# EAGLE design RAILbooster (EAGLE 6.1)
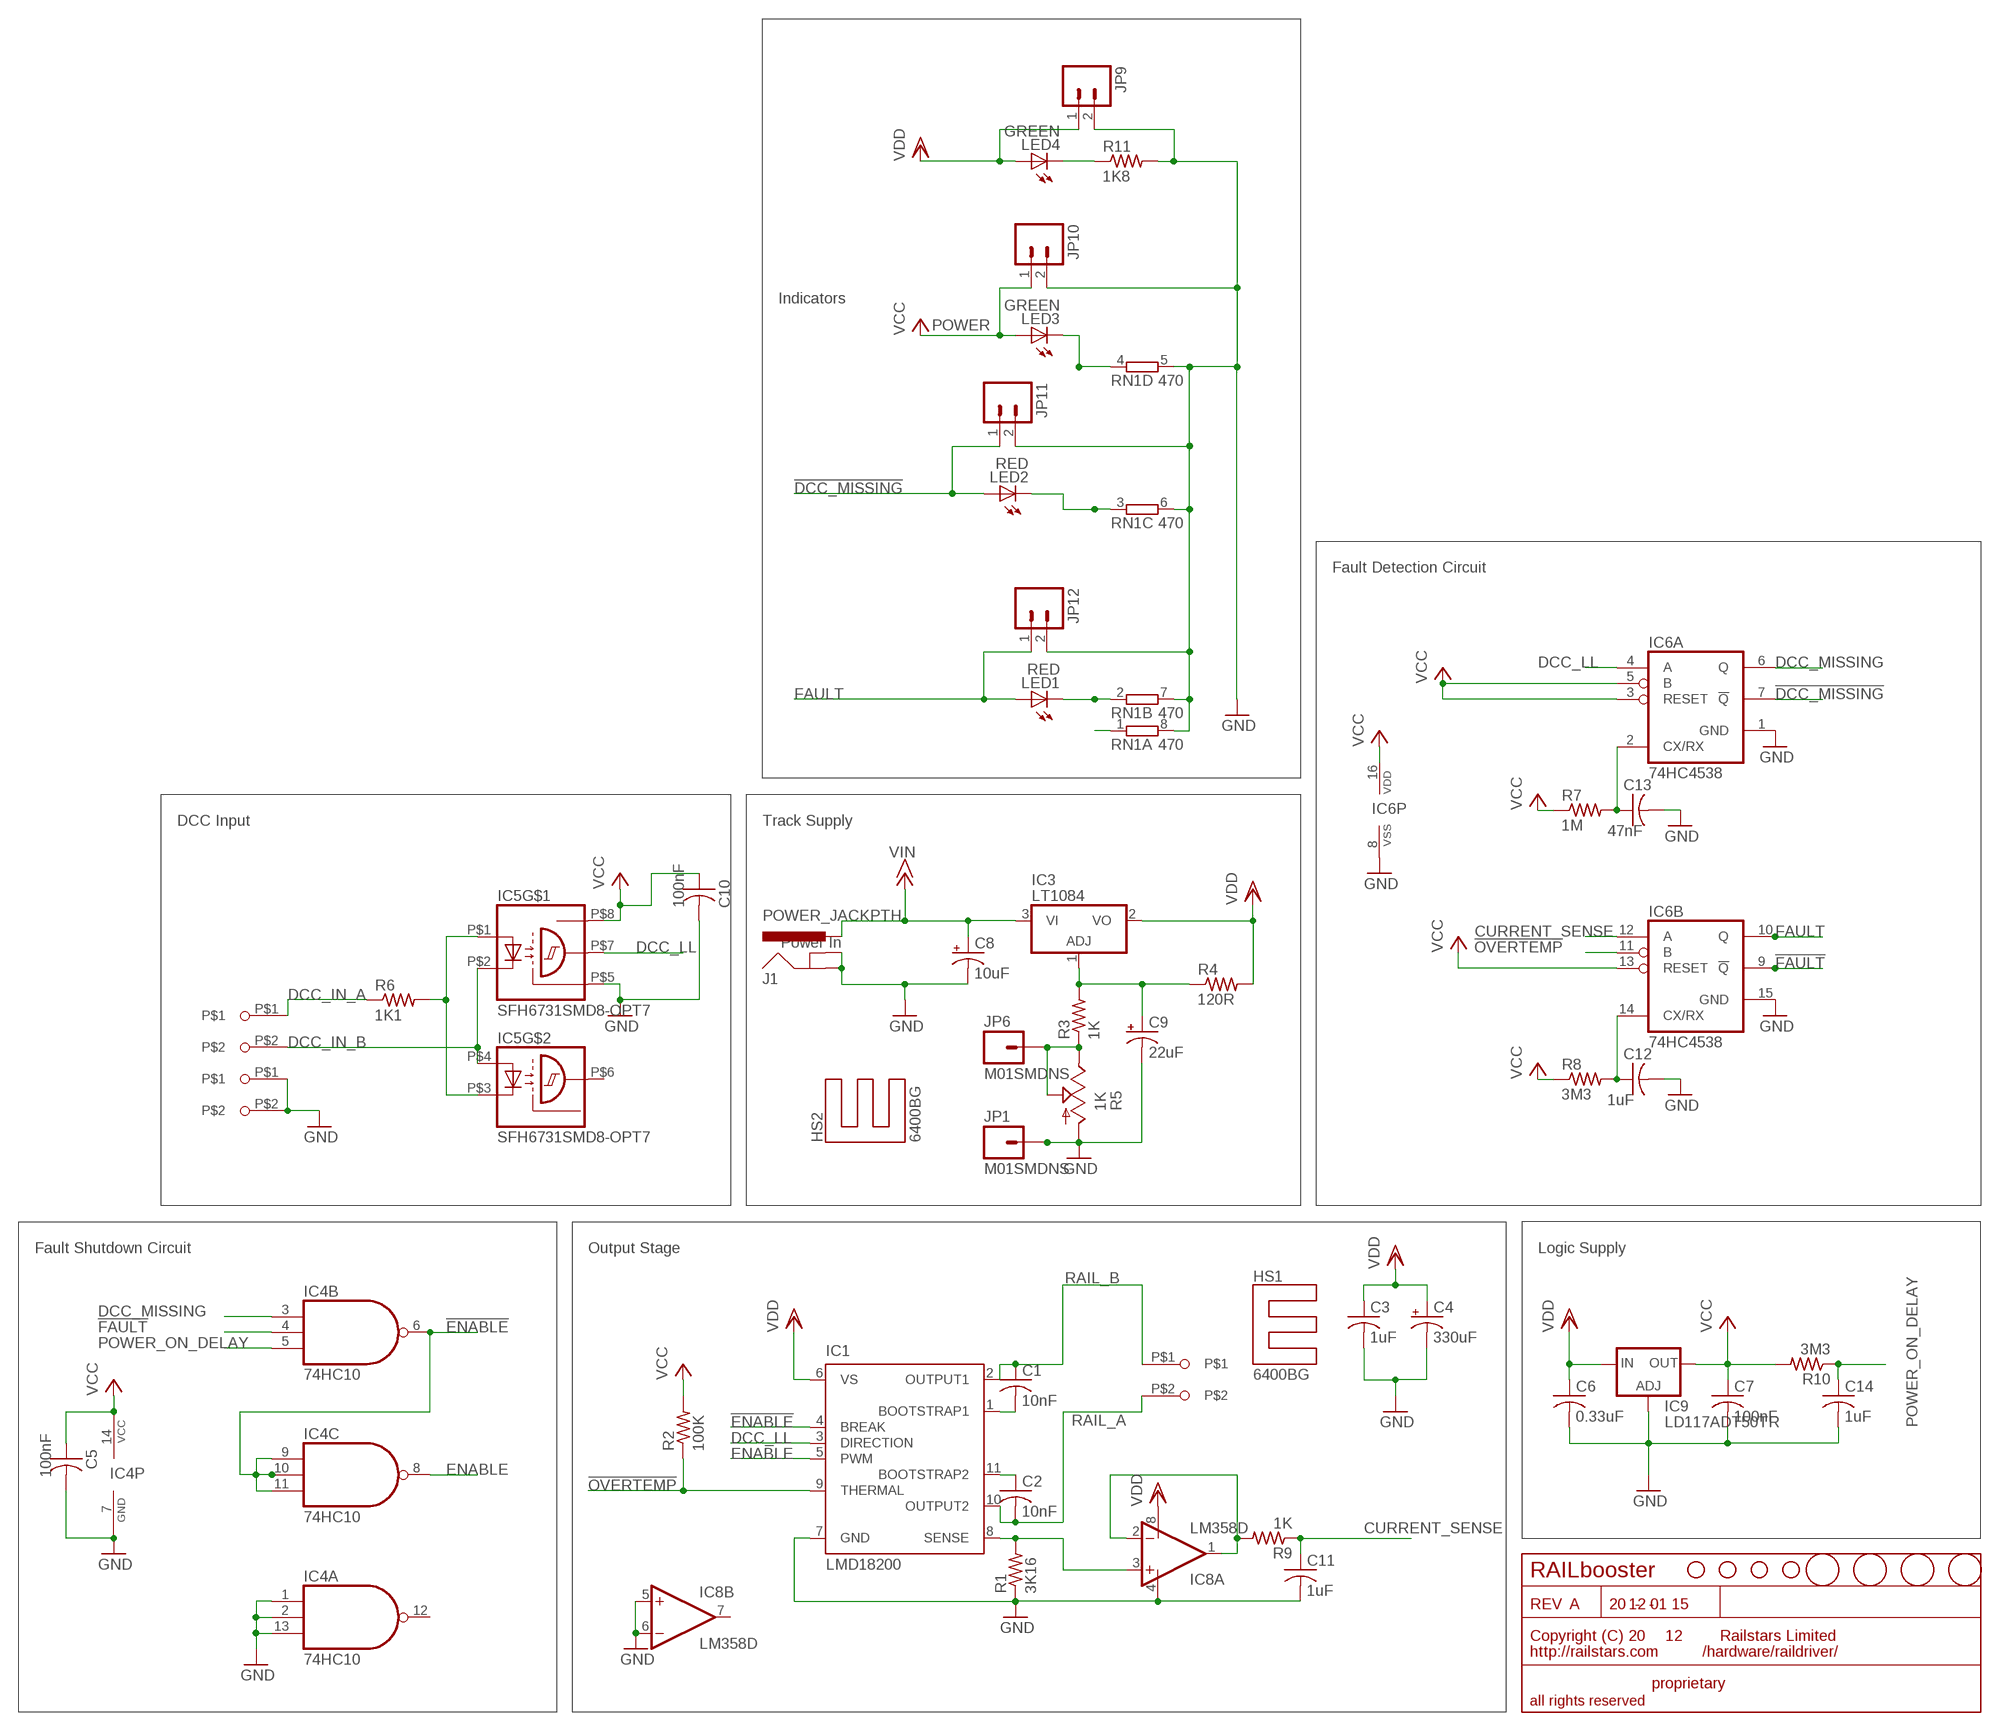
[diagram p0: schematic, sheet 1]

## Parts
C1  10nF  C-USC0603  [C0603]
C2  10nF  C-USC0603  [C0603]
C3  1uF  C-USC0603  [C0603]
C4  330uF  CPOL-USE5-10.5  [E5-10,5]
C5  100nF  C-USC0603  [C0603]
C6  0.33uF  C-USC0603  [C0603]
C7  100nF  C-USC0603  [C0603]
C8  10uF  CPOL-USE2-5  [E2-5]
C9  22uF  CPOL-USE2-5  [E2-5]
C10  100nF  C-USC0603  [C0603]
C11  1uF  C-USC0603  [C0603]
C12  1uF  C-USC0603  [C0603]
C13  47nF  C-USC0603  [C0603]
C14  1uF  C-USC0603  [C0603]
HS1  6400BG  HEATSINK6400BG  [6400BG]
HS2  6400BG  HEATSINK6400BG  [6400BG]
IC1  LMD18200  LM18200T  [TO-220-11]
IC3  LT1084  LT1084CT  [TO-220]
IC4  74HC10  7410D  [SO14]
IC5  SFH6731SMD8-OPT7  [SMD8-OPT7]
IC6  74HC4538  74HC4538SOIC  [SOIC-16]
IC8  LM358D  [SO08]
IC9  LD117ADT50TR  [DPACK]
J1  POWER_JACKPTH  [POWER_JACK_PTH]
JP1  M01SMDNS  [1X01NS]
JP2  STAND-OFF  [STAND-OFF]
JP3  STAND-OFF  [STAND-OFF]
JP4  STAND-OFF  [STAND-OFF]
JP5  STAND-OFF  [STAND-OFF]
JP6  M01SMDNS  [1X01NS]
JP9  M02PTH  [1X02]
JP10  M02PTH  [1X02]
JP11  M02PTH  [1X02]
JP12  M02PTH  [1X02]
LED1  RED  LED0603  [LED-0603]
LED2  RED  LED0603  [LED-0603]
LED3  GREEN  LED0603  [LED-0603]
LED4  GREEN  LED0603  [LED-0603]
R1  3K16  R-US_R0603  [R0603]
R2  100K  R-US_R0603  [R0603]
R3  1K  R-US_R1206  [R1206]
R4  120R  R-US_R0603  [R0603]
R5  1K  TRIM_US-S64W  [S64W]
R6  1K1  R-US_R1206  [R1206]
R7  1M  R-US_R0603  [R0603]
R8  3M3  R-US_R0603  [R0603]
R9  1K  R-US_R1206  [R1206]
R10  3M3  R-US_R0603  [R0603]
R11  1K8  R-US_R1206  [R1206]
RN1  470  4R-NEXBS8V  [EXBS8V]
U$1  RAILSTARS_LOGO20MM  [RAILSTARS_1IN]
U$5  FIDUCIAL  [FIDUCIAL_1MM]
U$6  FIDUCIAL  [FIDUCIAL_1MM]
U$7  FIDUCIAL  [FIDUCIAL_1MM]
U$8  FIDUCIAL  [FIDUCIAL_1MM]
X1  SCREWTERMINAL-5.08-2  [SCREWTERMINAL-5.08-2]
X3  SCREWTERMINAL-5.08-2  [SCREWTERMINAL-5.08-2]
X4  SCREWTERMINAL-5.08-2  [SCREWTERMINAL-5.08-2]

## Nets
!DCC_MISSING: IC6.7(A:!Q) JP11.1 LED2.A
!ENABLE: IC1.4(BREAK) IC4.6(B:O) IC4.9(C:I0) IC4.10(C:I1) IC4.11(C:I2)
!FAULT: IC4.4(B:I1) IC6.9(B:!Q)
!OVERTEMP: IC1.9(THERMAL) IC6.11(B:B) R2.1
CURRENT_SENSE: C11.1 IC6.12(B:A) R9.1
CURRENT_SENSE_UNBUFFERED: IC8.1(A:OUT) IC8.2(A:-IN) R9.2
CXRXA: C13.1 IC6.2(A:CX/RX) R7.2
CXRXB: C12.1 IC6.14(B:CX/RX) R8.2
DCC_IN_A: R6.1 X1.P$1
DCC_IN_B: IC5.P$2(C) IC5.P$4(A) X1.P$2
DCC_LL: IC1.3(DIRECTION) IC5.P$7(OUT) IC6.4(A:A)
DCC_MISSING: IC4.3(B:I0) IC6.6(A:Q)
ENABLE: IC1.5(PWM) IC4.8(C:O)
FAULT: IC6.10(B:Q) JP12.1 LED1.A
GND: C3.2 C4.- C5.2 C6.2 C7.2 C8.- C9.- C10.2 C11.2 C12.2 C13.2 C14.2 IC1.7(GND) IC4.1(A:I0) IC4.2(A:I1) IC4.7(P:GND) IC4.13(A:I2) IC5.P$5(GND) IC6.1(A:GND) IC6.8(P:VSS) IC6.15(B:GND) IC8.4(P:V-) IC8.5(B:+IN) IC8.6(B:-IN) IC9.1(ADJ) J1.GND J1.GNDBREAK JP1.1 JP9.2 JP10.2 JP11.2 JP12.2 R1.1 R5.A R11.2 RN1.5 RN1.6 RN1.7 RN1.8 X3.P$1 X3.P$2
N$1: JP6.1 R3.1 R5.E R5.S
N$2: C1.2 IC1.1(BOOTSTRAP1)
N$3: C2.1 IC1.11(BOOTSTRAP2)
N$4: IC1.8(SENSE) IC8.3(A:+IN) R1.2
N$5: LED3.C RN1.4
N$6: C9.+ IC3.1(ADJ) R3.2 R4.1
N$7: IC5.P$1(A) IC5.P$3(C) R6.2
N$9: LED2.C RN1.3
N$10: LED1.C RN1.2
N$13: LED4.C R11.1
N$17: RN1.1
POWER_ON_DELAY: C14.1 IC4.5(B:I2) R10.1
RAIL_A: C2.2 IC1.10(OUTPUT2) X4.P$2
RAIL_B: C1.1 IC1.2(OUTPUT1) X4.P$1
VCC: C5.1 C7.1 C10.1 IC4.14(P:VCC) IC5.P$8(VCC) IC6.3(A:RESET) IC6.5(A:B) IC6.13(B:RESET) IC6.16(P:VDD) IC9.4(OUT) JP10.1 LED3.A R2.2 R7.1 R8.1 R10.2
VDD: C3.1 C4.+ C6.1 IC1.6(VS) IC3.2(VO) IC8.8(P:V+) IC9.3(IN) JP9.1 LED4.A R4.2
VIN: C8.+ IC3.3(VI) J1.PWR
Unconnected: IC4.12(A:O) IC5.P$6(OUT) IC8.7(B:OUT)

## Notes on the sheet
- Indicators
- POWER
- Fault Detection Circuit
- DCC Input | Track Supply
- Power In
- Fault Shutdown Circuit | Output Stage | Logic Supply
- RAILbooster
- A | 12 01 15
- 12
- /hardware/raildriver/
- proprietary
- all rights reserved

## Library data of the parts
C1-C3 C5-C7 C10-C14 = rcl:C-US: CAPACITOR, American symbol
C4 C8 C9 = rcl:CPOL-US: POLARIZED CAPACITOR, American symbol
HS1 HS2 = Artificial Science:HEATSINK
IC1 = national-semiconductor:LM18200T: 3A, 55V H-Bridge Motor Control SourcE: http://cache.national.com/ds/LM/LMD18200.pdf; OC_FARNELL: unknown; OC_NEWARK: unknown
IC3 = Artificial Science:LT1084CT
IC4 = 74xx-us:74*10: Triple 3-input NAND gate
IC5 = Artificial Science:SFH6731
IC6 = Artificial Science:74HC4538
IC8 = linear:LM358: OP AMP also LM158; LM258; LM2904 Source: http://cache.national.com/ds/LM/LM158.pdf
IC9 = v-reg:LD117A?*: Low drop fixed and adjustable positive voltage regulators 1 A Source: http://www.st.com/stonline/products/literature/ds/7194/ld1117axx.pdf
J1 = SparkFun:POWER_JACK: Power Jack This is the standard 5.5mm barrel jack for power. The PTH is the most common, proven, reliable, footprint. All others are experimental. The Slot footprint only works if the mill layer is transmitted to the PCB fab house so be warned. Spark Fun Electronics SKU : PRT-00119. Mating wall wart : TOL-00298 (and others)
JP1 JP6 = SparkFun-Connectors:M01: Header 1 Standard 1-pin 0.1" header. Use with straight break away headers (SKU : PRT-00116), right angle break away headers (PRT-00553), swiss pins (PRT-00743), machine pins (PRT-00117), and female headers (PRT-00115).
JP2-JP5 = SparkFun:STAND-OFF: Stand Off This is the mechanical footprint for a #4 phillips button head screw. Use the keepout ring to avoid running the screw head into surrounding components. SKU : PRT-00447
JP9-JP12 = SparkFun-Connectors:M02: Header 2 Standard 2-pin 0.1" header. Use with straight break away headers (SKU : PRT-00116), right angle break away headers (PRT-00553), swiss pins (PRT-00743), machine pins (PRT-00117), and female headers (PRT-00115). Molex polarized connector foot print use with SKU : PRT-08233 with associated crimp pins and housings.
LED1-LED4 = SparkFun:LED: LEDs Standard schematic elements and footprints for 5mm, 3mm, 1206, and 0603 sized LEDs. 5mm - Spark Fun Electronics SKU : COM-00529 (and others)
R1-R4 R6-R11 = rcl:R-US_: RESISTOR, American symbol
R5 = pot:TRIM_US-: POTENTIOMETER
RN1 = resistor-dil:4R-N: Array Chip Resistor Source: RS Component / Phycomp; OC_FARNELL: unknown; OC_NEWARK: unknown
U$1 = Artificial Science:RAILSTARS_LOGO
U$5-U$8 = adafruit:FIDUCIAL: For use by pick and place machines to calibrate the vision/machine, 1mm By microbuilder.eu
X1 X3 X4 = Artificial Science:SCREWTERMINAL-5.08-2

## Board
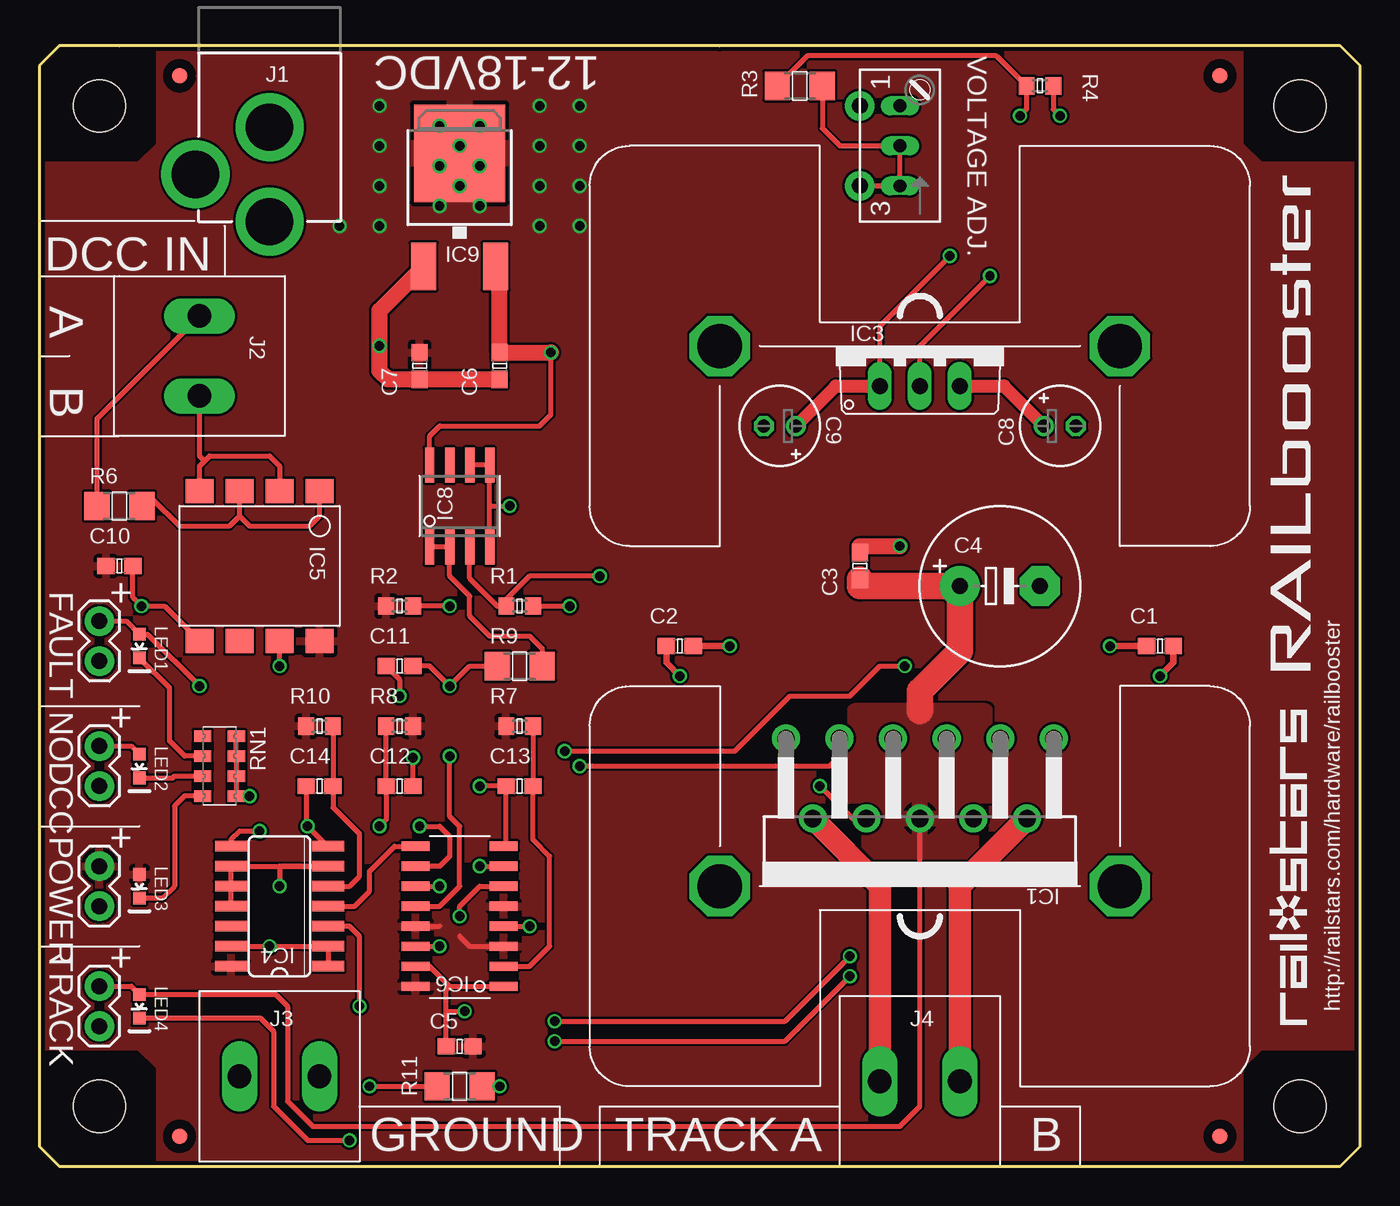
[diagram p1: board, top side]
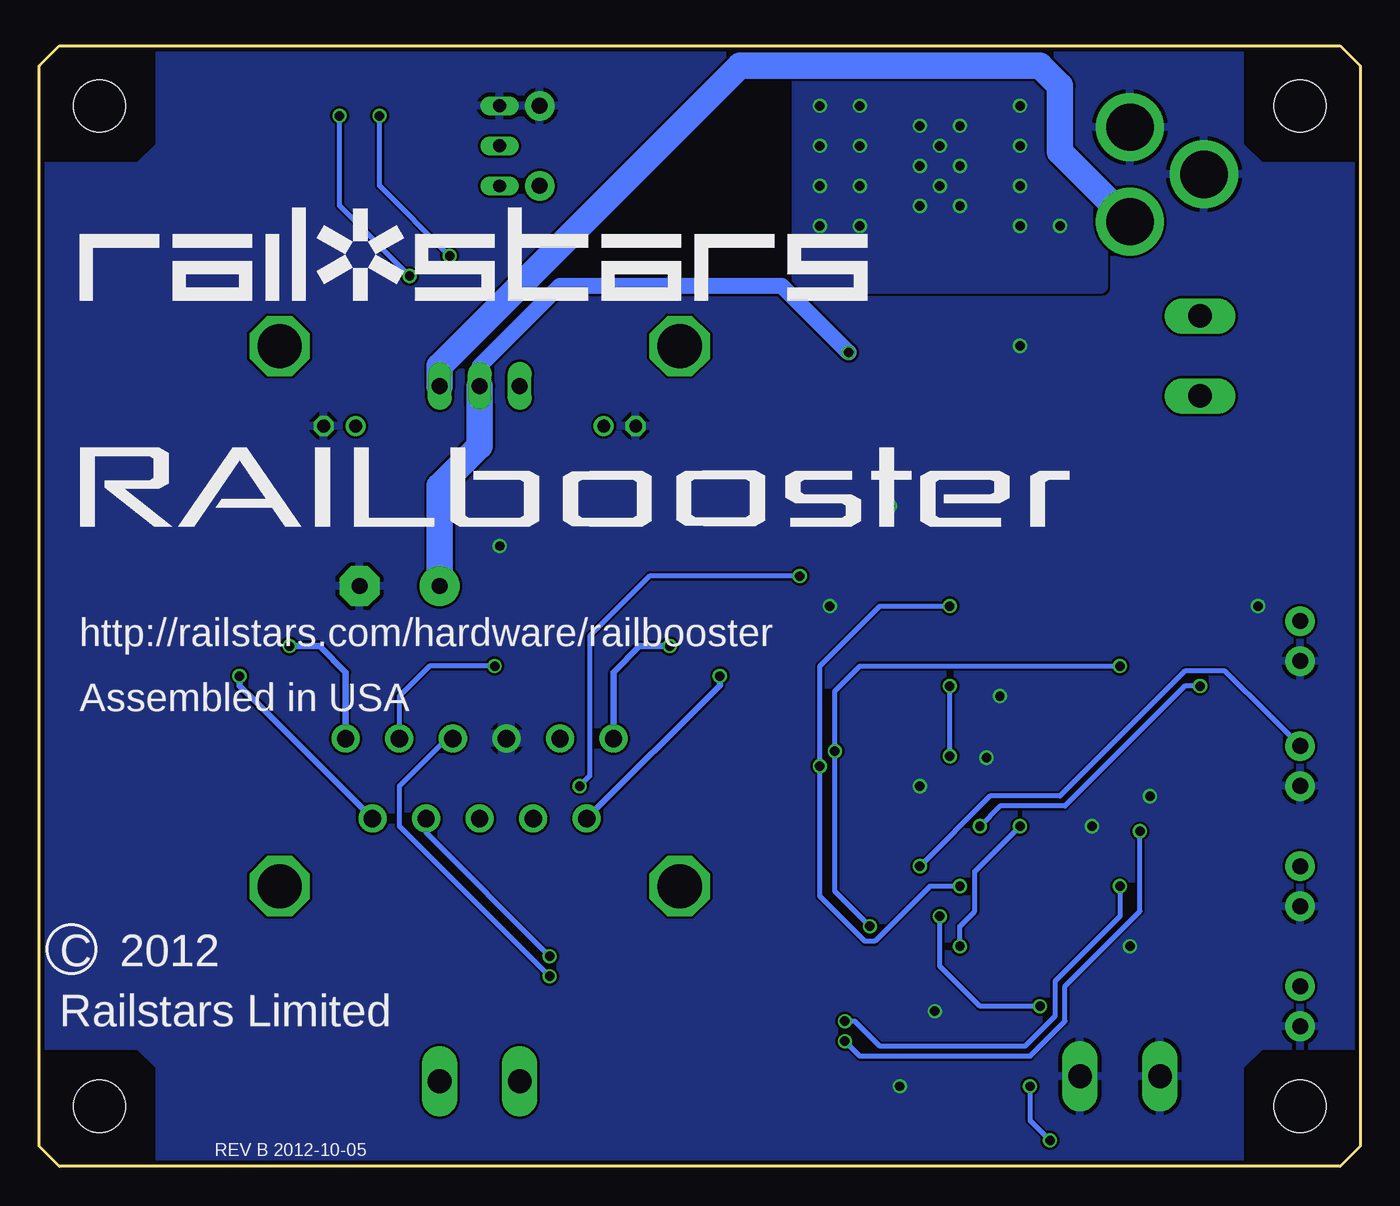
[diagram p2: board, bottom side, seen from below]

Size 83.82 x 71.12 mm. Coordinates in mm from the lower left corner, seen from the top.
Outline: 0,1.27 1.27,0 82.55,0 83.82,1.27 83.82,69.85 82.55,71.12 43.18,71.12 5.08,71.12 1.27,71.12 0,69.85 0,1.27
Copper layers (1*16): Top 0.035mm / dielectric 1.5mm / Bottom 0.035mm
Design rules: minimum track width 6mil, minimum drill 0.3mm, track to track 6mil, track to pad 6mil, pad to pad 6mil, via to via 6mil, smd to smd 0mil, copper to edge 10mil, drill to drill 10mil, minimum pad ring 5mil, minimum via ring 5mil, stop-mask expansion 2mil, vias tented up to drill 100mil, thermal gap 10mil

### Footprints (pad centres in the part's own frame; a part is rotated, then mirrored left to right if it is on the bottom)
C0603 = smd 1.1 x 1: 1 -0.85,0; 2 0.85,0
E5-10,5 = drill 1.016 pad 2.54: + -2.54,0 | drill 1.016 pad 2.54 octagon: - 2.54,0
E2-5 = drill 0.813 pad 1.27: + -1.016,0 | drill 0.813 pad 1.27 octagon: - 1.016,0
6400BG = drill 2.8 octagon: P$1 -12.7,0; P$2 12.7,0
TO-220-11 = drill 1.1 pad 1.778: 1 -8.5,-9.37; 2 -6.8,-4.29; 3 -5.1,-9.37; 4 -3.4,-4.29; 5 -1.7,-9.37; 6 0,-4.29; 7 1.7,-9.37; 8 3.4,-4.29; 9 5.1,-9.37; 10 6.8,-4.29; 11 8.5,-9.37
TO-220 = drill 1.016 long: 1 -2.54,0; 2 0,0; 3 2.54,0
SO14 = smd 0.66 x 2.032: 1 -3.81,-3.073; 2 -2.54,-3.073; 3 -1.27,-3.073; 4 0,-3.073; 5 1.27,-3.073; 6 2.54,-3.073; 7 3.81,-3.073; 8 3.81,3.073; 9 2.54,3.073; 10 1.27,3.073; 11 0,3.073; 12 -1.27,3.073; 13 -2.54,3.073; 14 -3.81,3.073
SMD8-OPT7 = smd 1.524 x 1.778: P$1 -4.763,3.81; P$2 -4.763,1.27; P$3 -4.763,-1.27; P$4 -4.763,-3.81; P$5 4.763,-3.81; P$6 4.763,-1.27; P$7 4.763,1.27; P$8 4.763,3.81
SOIC-16 = smd 1.778 x 0.584: 1 -2.794,8.89; 2 -2.794,7.62; 3 -2.794,6.35; 4 -2.794,5.08; 5 -2.794,3.81; 6 -2.794,2.54; 7 -2.794,1.27; 8 -2.794,0; 9 2.794,0; 10 2.794,1.27; 11 2.794,2.54; 12 2.794,3.81; 13 2.794,5.08; 14 2.794,6.35; 15 2.794,7.62; 16 2.794,8.89
SO08 = smd 0.6 x 2.2: 1 -1.905,-2.6; 2 -0.635,-2.6; 3 0.635,-2.6; 4 1.905,-2.6; 5 1.905,2.6; 6 0.635,2.6; 7 -0.635,2.6; 8 -1.905,2.6
DPACK = smd 1.6 x 3: 1 -2.28,-4.8; 3 2.28,-4.8 | smd 5.8 x 6.2: 4 0,2.38
POWER_JACK_PTH = drill 2.997 pad 4.318: GND 0,7.7; GNDBREAK 4.7,10.7; PWR 0,13.7
1X01NS = drill 1.016 pad 1.88: 1 0,0
STAND-OFF = hole 3.302: 0,0
1X02 = drill 1.016 pad 1.88: 1 0,0; 2 2.54,0
LED-0603 = smd 0.8 x 0.8: A 0,-0.75; C 0,0.75
R0603 = smd 1 x 1.1: 1 -0.85,0; 2 0.85,0
R1206 = smd 1.6 x 1.803: 1 -1.422,0; 2 1.422,0
S64W = drill 0.813 long: A 2.54,1.27; E -2.54,1.27; S 0,1.27
EXBS8V = smd 0.75 x 1.1: 1 -1.905,-1.07; 2 -0.635,-1.07; 3 0.635,-1.07; 4 1.905,-1.07; 5 1.905,1.07; 6 0.635,1.07; 7 -0.635,1.07; 8 -1.905,1.07
FIDUCIAL_1MM = smd 1 x 1: 1 0,0
SCREWTERMINAL-5.08-2 = drill 1.5 long: P$1 0,0; P$2 5.08,0

### Placement (x,y rotation side)
C1  71.12,33.02 180 top
C2  40.64,33.02 180 top
C3  52.07,38.1 90 top
C4  60.96,36.83 0 top
C5  26.67,7.62 180 top
C6  29.21,50.8 270 top
C7  24.13,50.8 270 top
C8  64.77,46.99 0 top
C9  46.99,46.99 180 top
C10  5.08,38.1 0 top
C11  22.86,31.75 180 top
C12  22.86,24.13 0 top
C13  30.48,24.13 180 top
C14  17.78,24.13 180 top
HS1  55.88,17.78 180 top
HS2  55.88,52.07 0 top
IC1  55.88,17.78 180 top
IC3  55.88,49.53 0 top
IC4  15.24,16.51 90 top
IC5  13.97,38.1 270 top
IC6  26.67,20.32 180 top
IC8  26.67,41.91 0 top
IC9  26.67,61.91 0 top
J1  14.61,73.66 180 top
JP1  52.07,67.31 0 top
JP2  3.81,67.31 0 top
JP3  3.81,3.81 0 top
JP4  80.01,3.81 0 top
JP5  80.01,67.31 0 top
JP6  52.07,62.23 0 top
JP9  3.81,11.43 270 top
JP10  3.81,19.05 270 top
JP11  3.81,26.67 270 top
JP12  3.81,34.61 270 top
LED1  6.35,33.02 180 top
LED2  6.35,25.4 180 top
LED3  6.35,17.78 180 top
LED4  6.35,10.16 180 top
R1  30.48,35.56 180 top
R2  22.86,35.56 180 top
R3  48.26,68.58 180 top
R4  63.5,68.58 0 top
R5  55.88,64.77 90 top
R6  5.08,41.91 0 top
R7  30.48,27.94 0 top
R8  22.86,27.94 180 top
R9  30.48,31.75 0 top
R10  17.78,27.94 180 top
R11  26.67,5.08 0 top
RN1  11.43,25.4 270 top
U$1  80.64,8.57 90 top
U$2  [LOGO_RAILBOOSTER_5MM]  81.28,40.64 0 bottom
U$3  [LOGO_RAILBOOSTER_2.5MM]  80.64,31.43 90 top
U$4  [RAILSTARS_50MM]  81.28,54.93 0 bottom
U$5  8.89,1.91 0 top
U$6  74.93,1.91 0 top
U$7  8.89,69.22 0 top
U$8  74.93,69.22 0 top
X1  10.16,53.98 270 top
X3  17.78,5.71 180 top
X4  58.42,5.4 180 top

### Tracks (layer width: path | path; a pad name or v marks a point on that pad's centre or on a via)
!DCC_MISSING  (via drill 0.6)
  Top 0.305: v27.94,19.05 IC6.7 | JP11.1 5.83,26.67 LED2.A
  Bottom 0.305: v27.94,19.05 23.5,23.5 19.05,23.5 11.11,31.43 8.57,31.43 5.71,28.57 JP11.1
!ENABLE  (via drill 0.6)
  Top 0.305: IC4.11 IC4.10 IC4.9 IC4.6 15.24,19.05 v15.24,17.78 | v32.7,9.21 47.31,9.21 v51.44,13.34
  Bottom 0.305: IC1.4 59.28,21.18 v51.44,13.34 | v15.24,17.78 15.24,15.88 19.37,11.75 19.37,9.53 21.27,7.62 30.48,7.62 32.07,9.21 v32.7,9.21
!FAULT
  Top 0.305: IC6.9 22.54,20.32 20.95,18.73 20.95,17.46 20,16.51 IC4.4
!OVERTEMP  (via drill 0.6)
  Top 0.305: IC6.11 v25.4,17.78 | IC1.9 50.78,26.02 50.16,25.4 v34.29,25.4 | v26.04,35.56 R2.1
  Bottom 0.305: v25.4,17.78 27.3,17.78 30.8,14.29 31.43,14.29 34.29,17.14 v34.29,25.4 34.29,31.75 30.48,35.56 v26.04,35.56
CURRENT_SENSE  (via drill 0.6)
  Top 0.305: IC6.12 25.4,16.51 26.67,17.78 26.67,21.59 26.04,22.23 v26.04,26.04 | C11.1 24.77,31.75 v26.04,30.48 27.3,31.75 R9.1
  Bottom 0.305: v26.04,26.04 v26.04,30.48
CURRENT_SENSE_UNBUFFERED
  Top 0.305: R9.2 31.9,32.87 31.11,33.66 28.57,33.66 27.3,34.92 27.3,36.2 26.04,37.47 IC8.2 IC8.1
CXRXA
  Top 0.305: IC6.2 31.11,12.7 32.38,13.97 32.38,19.68 31.33,20.74 C13.1 R7.2
CXRXB  (via drill 0.6)
  Top 0.305: IC6.14 v25.4,13.97 | 21.91,21.91 v21.59,21.59 22.01,22.01 C12.1 R8.2
  Bottom 0.305: v25.4,13.97 25.4,15.24 24.45,16.19 24.45,18.73 v21.59,21.59
DCC_IN_A
  Top 0.305: X1.P$1 3.66,47.47 R6.1
DCC_IN_B
  Top 0.305: IC5.P$2 15.24,44.45 14.61,45.09 10.79,45.09 10.48,44.77 | 10.48,44.77 10.16,44.45 IC5.P$4 | X1.P$2 10.16,45.09 10.48,44.77
DCC_LL  (via drill 0.6)
  Top 0.305: v33.34,26.35 44.13,26.35 47.62,29.84 51.44,29.84 53.34,31.75 v54.93,31.75 | IC6.4 v31.11,15.24 | v15.24,31.75 IC5.P$7
  Bottom 0.305: IC1.3 60.98,29.82 59.05,31.75 v54.93,31.75 | v31.11,15.24 33.34,17.46 v33.34,26.35 33.34,30.16 31.75,31.75 v15.24,31.75
DCC_MISSING  (via drill 0.6)
  Top 0.305: IC6.6 27.94,17.78 26.67,16.51 v26.67,15.88 | IC4.3 19.68,15.24 20.32,14.61 v20.32,10.16
  Bottom 0.305: v26.67,15.88 26.67,12.7 24.13,10.16 v20.32,10.16
ENABLE  (via drill 0.6)
  Top 0.305: v13.97,21.27 12.7,21.27 12.17,20.74 IC4.8 | v32.7,7.94 47.31,7.94 v51.44,12.06
  Bottom 0.305: IC1.5 57.94,27.15 60.96,24.13 60.96,21.59 v51.44,12.06 | v13.97,21.27 13.97,16.19 18.73,11.43 18.73,9.21 20.95,6.99 31.75,6.99 v32.7,7.94
FAULT  (via drill 0.6)
  Top 0.305: v24.13,21.59 25.4,21.59 26.04,20.95 26.04,19.68 25.4,19.05 IC6.10 | v10.16,30.48 6.87,33.77 LED1.A 5.51,34.61 JP12.1
  Bottom 0.305: v24.13,21.59 22.86,22.86 18.73,22.86 11.11,30.48 v10.16,30.48
GND  (via drill 0.6)
  Top 0.305: IC4.1 IC4.2 IC4.13 v14.61,13.97 | IC4.7 18.29,20.32 v17.02,21.59 16.93,21.68 C14.2 | R1.1 v33.66,35.56 | IC8.6 IC8.5 IC8.4 28.57,41.91 v29.84,41.91 | IC5.P$5 7.94,35.56 v6.48,35.56 5.93,36.11 C10.2 | IC6.15 24.77,12.7 26.04,11.43 | 26.04,11.43 IC6.1 | 25.82,9.84 v26.99,9.84 | RN1.8 RN1.7 RN1.6 RN1.5 v13.34,23.5 | R11.2 v29.21,5.08 | C11.2 22.86,30.9 v22.86,29.84 | C12.2 v23.71,25.93 | IC6.8 29.63,20.49 C13.2 v27.94,24.13 | C5.2 25.82,9.84 | 25.82,9.84 25.82,11.21 26.04,11.43
  Top 1.016: v54.61,39.37 52.07,39.37 C3.2 | C6.2 C7.2 22.12,49.95 21.59,50.48 v21.59,52.07 21.59,54.31 IC9.1
  pour Bottom (rank 4): 0,7.62 6.35,7.62 7.62,6.35 7.62,0 76.2,0 76.2,6.35 77.47,7.62 83.82,7.62 83.82,63.5 77.47,63.5 76.2,64.77 76.2,71.12 7.62,71.12 7.62,64.77 6.35,63.5 0,63.5
  pour Bottom: 52.39,25.4 55.88,25.4 55.88,29.21 52.39,29.21
N$1
  Top 0.305: R3.1 49.68,65.89 50.8,64.77 R5.S R5.E JP6.1
N$2  (via drill 0.6)
  Top 0.406: v67.94,33.02 C1.2
  Bottom 0.406: IC1.1 64.38,31.36 66.04,33.02 v67.94,33.02
N$3  (via drill 0.6)
  Top 0.406: v43.81,33.02 C2.1
  Bottom 0.406: IC1.11 47.38,31.36 45.72,33.02 v43.81,33.02
N$4  (via drill 0.6)
  Top 0.305: IC1.8 51.59,22.07 v49.53,24.13 | IC8.3 27.3,37.31 29.06,35.56 R1.2 29.63,35.98 31.11,37.47 v35.56,37.47
  Bottom 0.305: v35.56,37.47 45.09,37.47 48.9,33.66 48.9,24.77 v49.53,24.13
N$5
  Top 0.305: RN1.4 9.21,23.5 8.57,22.86 8.57,17.78 7.82,17.03 LED3.C
N$6  (via drill 0.6)
  Top 0.305: v57.78,57.78 53.34,53.34 IC3.1 | R3.2 48.74,70.48 60.74,70.48 R4.1 62.65,67.09 v62.23,66.67
  Top 0.813: IC3.1 50.55,49.53 C9.+
  Bottom 0.305: v57.78,57.78 62.23,62.23 v62.23,66.67
N$7
  Top 0.305: R6.2 7.14,42.55 7.14,42.39 8.89,40.64 12.06,40.64 12.7,41.27 | IC5.P$1 17.78,41.27 17.14,40.64 13.34,40.64 12.7,41.27 | 12.7,41.27 IC5.P$3
N$9
  Top 0.305: LED2.C 8.46,24.65 8.57,24.77 RN1.3
N$10
  Top 0.305: RN1.2 9.21,26.04 8.26,26.99 8.26,30.36 LED1.C
N$13  (via drill 0.6)
  Top 0.305: LED4.C 14.02,9.41 14.86,8.57 14.86,3.81 17.02,1.65 v19.68,1.65 | v20.95,5.08 R11.1
  Bottom 0.305: v20.95,5.08 20.95,2.92 v19.68,1.65
POWER_ON_DELAY
  Top 0.305: IC4.5 19.68,17.78 20.32,18.41 20.32,21.09 18.63,22.77 C14.1 R10.1
RAIL_A  (via drill 0.6)
  Top 0.406: C2.2 39.79,31.96 v40.64,31.11
  Top 1.422: IC1.10 53.34,17.81 X4.P$2
  Bottom 0.406: v40.64,31.11 40.64,30.51 IC1.10
RAIL_B  (via drill 0.6)
  Top 0.406: C1.1 71.97,31.96 v71.12,31.11
  Top 1.422: IC1.2 58.4,17.79 58.42,17.77 X4.P$1
  Bottom 0.406: IC1.2 70.61,30 70.64,30 71.12,30.48 v71.12,31.11
VCC  (via drill 0.6)
  Top 0.305: IC6.13 25.4,15.24 | 26.67,14.61 27.3,13.97 IC6.3
  other vias: 27.94,66.04 27.94,63.5 25.4,63.5 25.4,66.04 26.67,64.77 26.67,62.23 21.59,67.31 31.75,62.23 31.75,67.31 31.75,59.69 21.59,64.77 34.29,62.23 25.4,60.96 27.94,60.96 21.59,59.69 21.59,62.23 34.29,64.77 34.29,67.31 34.29,59.69 31.75,64.77 19.05,59.69
  pour Top (rank 2): 0,7.62 6.35,7.62 7.62,6.35 7.62,0 76.2,0 76.2,6.35 77.47,7.62 83.82,7.62 83.82,63.5 77.47,63.5 76.2,64.77 76.2,71.12 7.62,71.12 7.62,64.77 6.35,63.5 0,63.5
  pour Top: 21.59,68.58 31.43,68.58 31.43,60.33 21.59,60.33
  pour Bottom (rank 2, no thermals): 16.51,71.12 16.51,55.88 35.56,55.88 35.56,71.12
VDD  (via drill 0.6)
  Top 0.305: IC3.2 55.88,52.07 v60.33,56.52 | IC1.6 55.88,3.81 54.61,2.54 17.34,2.54 15.75,4.13 15.75,10.16 15,10.91 LED4.A 5.83,11.43 JP9.1 | IC8.8 24.77,46.35 25.4,46.99 31.75,46.99 32.47,47.71 v32.47,51.65 | R4.2 64.35,67.09 v64.77,66.67
  Top 1.016: IC9.3 29.21,56.85 C6.1 v32.47,51.65
  Top 1.676: C3.1 52.07,36.83 C4.+ 58.42,32.7 55.88,30.16 55.88,28.89
  Bottom 0.305: v60.33,56.52 64.77,60.96 v64.77,66.67
  Bottom 1.016: 55.88,48.26 55.88,50.8 50.8,55.88 36.7,55.88 v32.47,51.65
  Bottom 1.676: IC3.2 55.88,48.26 55.88,45.72 58.42,43.18 C4.+
  pour Top: 51.75,20 60.01,20 60.01,28.89 51.75,28.89
VIN
  Top 0.813: IC3.3 61.21,49.53 C8.+
  Bottom 1.676: IC3.3 58.42,50.8 39.37,69.85 20.32,69.85 19.05,68.58 19.05,64.41 J1.PWR

### Text on the board
tPlace: 12-18VDC | VOLTAGE ADJ. | DCC IN | A | J2 | B | FAULT | + | NO | + | DCC | POWER | + | TRACK | + | http://railstars.com/hardware/railbooster | J3 | J4 | GROUND | TRACK | A | B
bPlace: http://railstars.com/hardware/railbooster | Assembled in USA | 2012 | C | Railstars Limited | REV B 2012-10-05